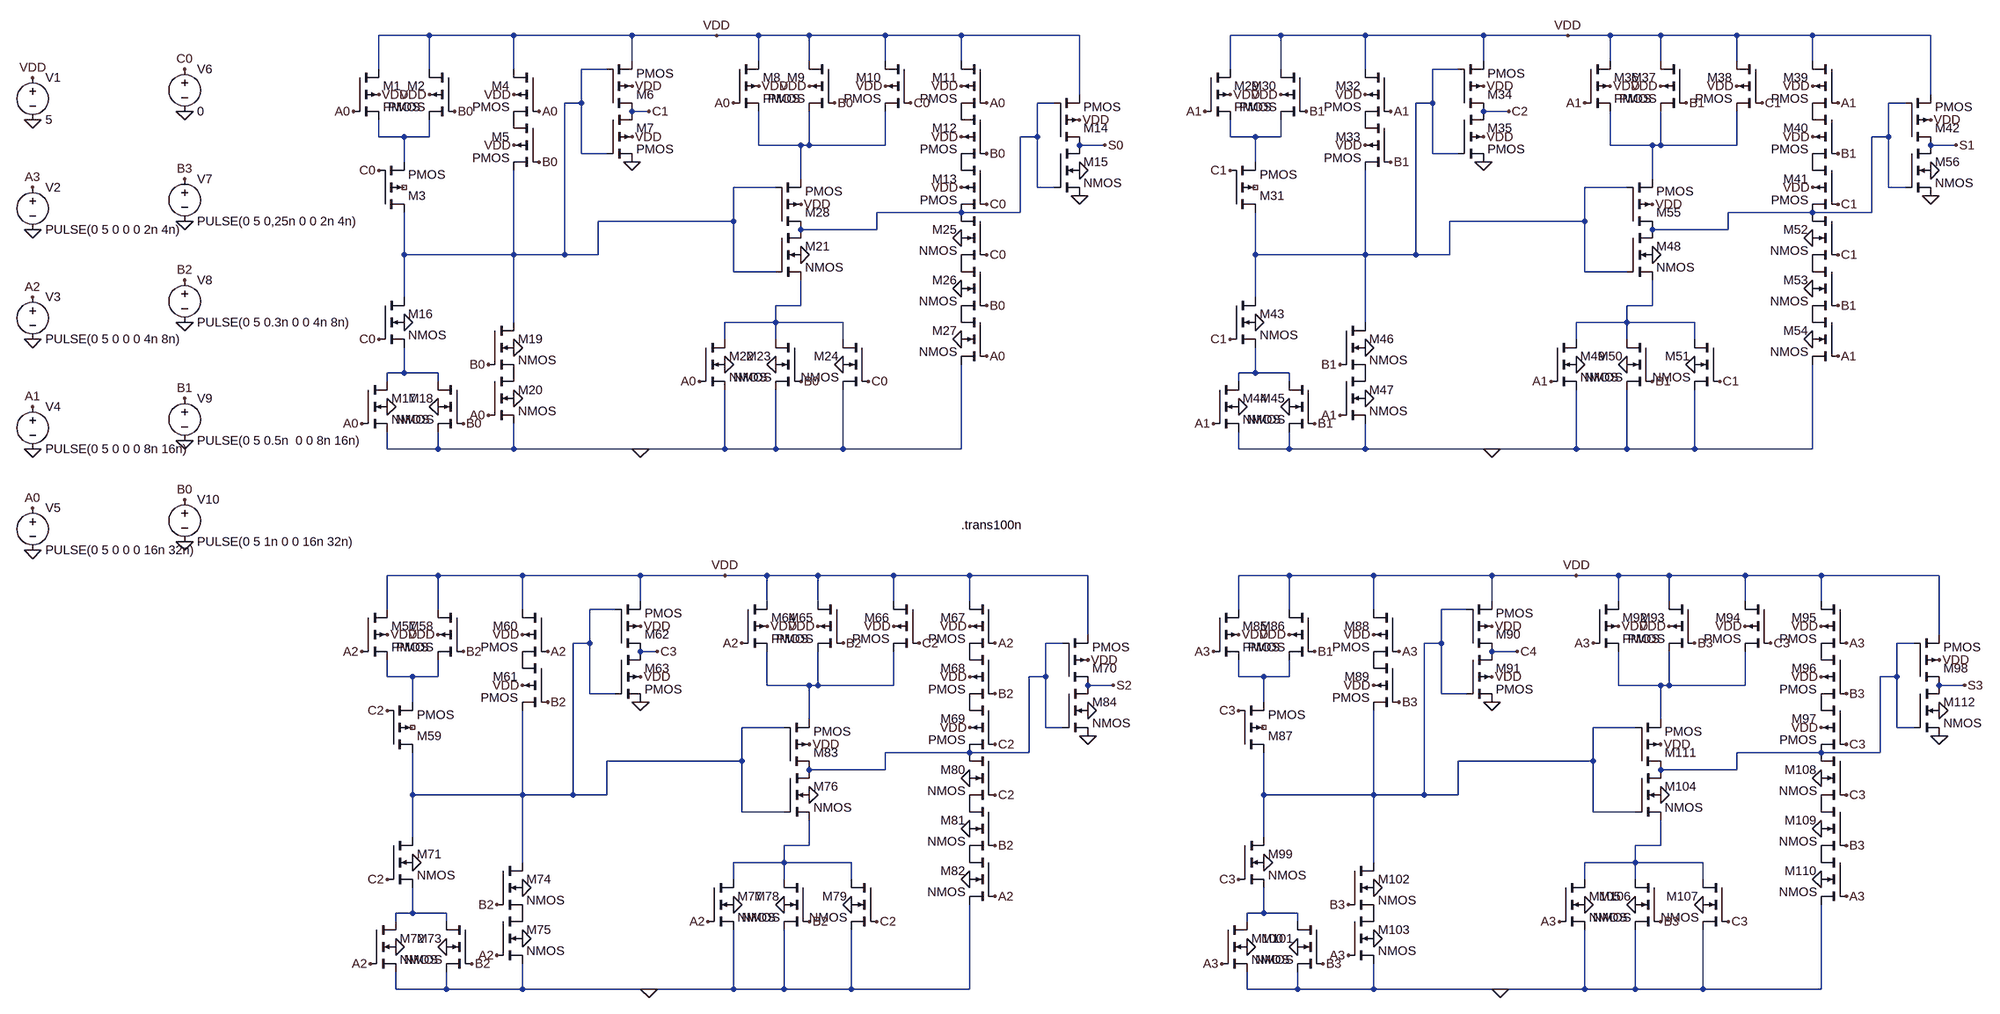
[diagram p0: schematic RIPPLE CARRY ADDER (1).asc]
RIPPLE CARRY ADDER (1).asc, the LTspice schematic file:
Version 4
SHEET 1 3168 1812
WIRE 160 -16 64 -16
WIRE 320 -16 160 -16
WIRE 544 -16 320 -16
WIRE 704 -16 544 -16
WIRE 784 -16 704 -16
WIRE 880 -16 784 -16
WIRE 1024 -16 880 -16
WIRE 1168 -16 1024 -16
WIRE 1392 -16 1168 -16
WIRE 1792 -16 1696 -16
WIRE 1952 -16 1792 -16
WIRE 2176 -16 1952 -16
WIRE 2336 -16 2176 -16
WIRE 2416 -16 2336 -16
WIRE 2512 -16 2416 -16
WIRE 2656 -16 2512 -16
WIRE 2800 -16 2656 -16
WIRE 3024 -16 2800 -16
WIRE 544 32 544 -16
WIRE 784 32 784 -16
WIRE 880 32 880 -16
WIRE 1024 32 1024 -16
WIRE 1168 32 1168 -16
WIRE 2176 32 2176 -16
WIRE 2416 32 2416 -16
WIRE 2512 32 2512 -16
WIRE 2656 32 2656 -16
WIRE 2800 32 2800 -16
WIRE 64 48 64 -16
WIRE 160 48 160 -16
WIRE 320 48 320 -16
WIRE 496 48 448 48
WIRE 1696 48 1696 -16
WIRE 1792 48 1792 -16
WIRE 1952 48 1952 -16
WIRE 2128 48 2080 48
WIRE 1392 96 1392 -16
WIRE 3024 96 3024 -16
WIRE 448 112 448 48
WIRE 448 112 416 112
WIRE 1344 112 1312 112
WIRE 2080 112 2080 48
WIRE 2080 112 2048 112
WIRE 2976 112 2944 112
WIRE 576 128 544 128
WIRE 2224 128 2176 128
WIRE 64 176 64 144
WIRE 112 176 64 176
WIRE 160 176 160 144
WIRE 160 176 112 176
WIRE 1312 176 1312 112
WIRE 1312 176 1280 176
WIRE 1696 176 1696 144
WIRE 1744 176 1696 176
WIRE 1792 176 1792 144
WIRE 1792 176 1744 176
WIRE 2944 176 2944 112
WIRE 2944 176 2912 176
WIRE 784 192 784 128
WIRE 864 192 784 192
WIRE 880 192 880 128
WIRE 880 192 864 192
WIRE 1024 192 1024 128
WIRE 1024 192 880 192
WIRE 1440 192 1392 192
WIRE 2416 192 2416 128
WIRE 2496 192 2416 192
WIRE 2512 192 2512 128
WIRE 2512 192 2496 192
WIRE 2656 192 2656 128
WIRE 2656 192 2512 192
WIRE 3072 192 3024 192
WIRE 448 208 448 112
WIRE 496 208 448 208
WIRE 2080 208 2080 112
WIRE 2128 208 2080 208
WIRE 112 224 112 176
WIRE 1744 224 1744 176
WIRE 864 256 864 192
WIRE 2496 256 2496 192
WIRE 816 272 736 272
WIRE 1312 272 1312 176
WIRE 1344 272 1312 272
WIRE 2448 272 2368 272
WIRE 2944 272 2944 176
WIRE 2976 272 2944 272
WIRE 1168 320 1008 320
WIRE 1280 320 1280 176
WIRE 1280 320 1168 320
WIRE 2800 320 2640 320
WIRE 2912 320 2912 176
WIRE 2912 320 2800 320
WIRE 736 336 736 272
WIRE 736 336 480 336
WIRE 2368 336 2368 272
WIRE 2368 336 2112 336
WIRE 1008 352 1008 320
WIRE 1008 352 864 352
WIRE 2640 352 2640 320
WIRE 2640 352 2496 352
WIRE 112 400 112 320
WIRE 320 400 320 240
WIRE 320 400 112 400
WIRE 416 400 416 112
WIRE 416 400 320 400
WIRE 480 400 480 336
WIRE 480 400 416 400
WIRE 1744 400 1744 320
WIRE 1952 400 1952 240
WIRE 1952 400 1744 400
WIRE 2048 400 2048 112
WIRE 2048 400 1952 400
WIRE 2112 400 2112 336
WIRE 2112 400 2048 400
WIRE 736 432 736 336
WIRE 816 432 736 432
WIRE 2368 432 2368 336
WIRE 2448 432 2368 432
WIRE 112 480 112 400
WIRE 1744 480 1744 400
WIRE 864 496 864 448
WIRE 864 496 816 496
WIRE 2496 496 2496 448
WIRE 2496 496 2448 496
WIRE 320 528 320 400
WIRE 816 528 816 496
WIRE 816 528 720 528
WIRE 944 528 816 528
WIRE 1952 528 1952 400
WIRE 2448 528 2448 496
WIRE 2448 528 2352 528
WIRE 2576 528 2448 528
WIRE 720 560 720 528
WIRE 816 560 816 528
WIRE 944 560 944 528
WIRE 2352 560 2352 528
WIRE 2448 560 2448 528
WIRE 2576 560 2576 528
WIRE 112 624 112 576
WIRE 112 624 80 624
WIRE 176 624 112 624
WIRE 1744 624 1744 576
WIRE 1744 624 1712 624
WIRE 1808 624 1744 624
WIRE 80 640 80 624
WIRE 176 640 176 624
WIRE 1712 640 1712 624
WIRE 1808 640 1808 624
WIRE 80 768 80 736
WIRE 176 768 176 736
WIRE 176 768 80 768
WIRE 320 768 320 720
WIRE 320 768 176 768
WIRE 560 768 320 768
WIRE 720 768 720 656
WIRE 720 768 560 768
WIRE 816 768 816 656
WIRE 816 768 720 768
WIRE 944 768 944 656
WIRE 944 768 816 768
WIRE 1168 768 1168 608
WIRE 1168 768 944 768
WIRE 1712 768 1712 736
WIRE 1808 768 1808 736
WIRE 1808 768 1712 768
WIRE 1952 768 1952 720
WIRE 1952 768 1808 768
WIRE 2192 768 1952 768
WIRE 2352 768 2352 656
WIRE 2352 768 2192 768
WIRE 2448 768 2448 656
WIRE 2448 768 2352 768
WIRE 2576 768 2576 656
WIRE 2576 768 2448 768
WIRE 2800 768 2800 608
WIRE 2800 768 2576 768
WIRE 176 1008 80 1008
WIRE 336 1008 176 1008
WIRE 560 1008 336 1008
WIRE 720 1008 560 1008
WIRE 800 1008 720 1008
WIRE 896 1008 800 1008
WIRE 1040 1008 896 1008
WIRE 1184 1008 1040 1008
WIRE 1408 1008 1184 1008
WIRE 1808 1008 1712 1008
WIRE 1968 1008 1808 1008
WIRE 2192 1008 1968 1008
WIRE 2352 1008 2192 1008
WIRE 2432 1008 2352 1008
WIRE 2528 1008 2432 1008
WIRE 2672 1008 2528 1008
WIRE 2816 1008 2672 1008
WIRE 3040 1008 2816 1008
WIRE 560 1056 560 1008
WIRE 800 1056 800 1008
WIRE 896 1056 896 1008
WIRE 1040 1056 1040 1008
WIRE 1184 1056 1184 1008
WIRE 2192 1056 2192 1008
WIRE 2432 1056 2432 1008
WIRE 2528 1056 2528 1008
WIRE 2672 1056 2672 1008
WIRE 2816 1056 2816 1008
WIRE 80 1072 80 1008
WIRE 176 1072 176 1008
WIRE 336 1072 336 1008
WIRE 512 1072 464 1072
WIRE 1712 1072 1712 1008
WIRE 1808 1072 1808 1008
WIRE 1968 1072 1968 1008
WIRE 2144 1072 2096 1072
WIRE 1408 1120 1408 1008
WIRE 3040 1120 3040 1008
WIRE 464 1136 464 1072
WIRE 464 1136 432 1136
WIRE 1360 1136 1328 1136
WIRE 2096 1136 2096 1072
WIRE 2096 1136 2064 1136
WIRE 2992 1136 2960 1136
WIRE 592 1152 560 1152
WIRE 2240 1152 2192 1152
WIRE 80 1200 80 1168
WIRE 128 1200 80 1200
WIRE 176 1200 176 1168
WIRE 176 1200 128 1200
WIRE 1328 1200 1328 1136
WIRE 1328 1200 1296 1200
WIRE 1712 1200 1712 1168
WIRE 1760 1200 1712 1200
WIRE 1808 1200 1808 1168
WIRE 1808 1200 1760 1200
WIRE 2960 1200 2960 1136
WIRE 2960 1200 2928 1200
WIRE 800 1216 800 1152
WIRE 880 1216 800 1216
WIRE 896 1216 896 1152
WIRE 896 1216 880 1216
WIRE 1040 1216 1040 1152
WIRE 1040 1216 896 1216
WIRE 1456 1216 1408 1216
WIRE 2432 1216 2432 1152
WIRE 2512 1216 2432 1216
WIRE 2528 1216 2528 1152
WIRE 2528 1216 2512 1216
WIRE 2672 1216 2672 1152
WIRE 2672 1216 2528 1216
WIRE 3088 1216 3040 1216
WIRE 464 1232 464 1136
WIRE 512 1232 464 1232
WIRE 2096 1232 2096 1136
WIRE 2144 1232 2096 1232
WIRE 128 1248 128 1200
WIRE 1760 1248 1760 1200
WIRE 880 1280 880 1216
WIRE 2512 1280 2512 1216
WIRE 832 1296 752 1296
WIRE 1328 1296 1328 1200
WIRE 1360 1296 1328 1296
WIRE 2464 1296 2384 1296
WIRE 2960 1296 2960 1200
WIRE 2992 1296 2960 1296
WIRE 1184 1344 1024 1344
WIRE 1296 1344 1296 1200
WIRE 1296 1344 1184 1344
WIRE 2816 1344 2656 1344
WIRE 2928 1344 2928 1200
WIRE 2928 1344 2816 1344
WIRE 752 1360 752 1296
WIRE 752 1360 496 1360
WIRE 2384 1360 2384 1296
WIRE 2384 1360 2128 1360
WIRE 1024 1376 1024 1344
WIRE 1024 1376 880 1376
WIRE 2656 1376 2656 1344
WIRE 2656 1376 2512 1376
WIRE 128 1424 128 1344
WIRE 336 1424 336 1264
WIRE 336 1424 128 1424
WIRE 432 1424 432 1136
WIRE 432 1424 336 1424
WIRE 496 1424 496 1360
WIRE 496 1424 432 1424
WIRE 1760 1424 1760 1344
WIRE 1968 1424 1968 1264
WIRE 1968 1424 1760 1424
WIRE 2064 1424 2064 1136
WIRE 2064 1424 1968 1424
WIRE 2128 1424 2128 1360
WIRE 2128 1424 2064 1424
WIRE 752 1456 752 1360
WIRE 832 1456 752 1456
WIRE 2384 1456 2384 1360
WIRE 2464 1456 2384 1456
WIRE 128 1504 128 1424
WIRE 1760 1504 1760 1424
WIRE 880 1520 880 1472
WIRE 880 1520 832 1520
WIRE 2512 1520 2512 1472
WIRE 2512 1520 2464 1520
WIRE 336 1552 336 1424
WIRE 832 1552 832 1520
WIRE 832 1552 736 1552
WIRE 960 1552 832 1552
WIRE 1968 1552 1968 1424
WIRE 2464 1552 2464 1520
WIRE 2464 1552 2368 1552
WIRE 2592 1552 2464 1552
WIRE 736 1584 736 1552
WIRE 832 1584 832 1552
WIRE 960 1584 960 1552
WIRE 2368 1584 2368 1552
WIRE 2464 1584 2464 1552
WIRE 2592 1584 2592 1552
WIRE 128 1648 128 1600
WIRE 128 1648 96 1648
WIRE 192 1648 128 1648
WIRE 1760 1648 1760 1600
WIRE 1760 1648 1728 1648
WIRE 1824 1648 1760 1648
WIRE 96 1664 96 1648
WIRE 192 1664 192 1648
WIRE 1728 1664 1728 1648
WIRE 1824 1664 1824 1648
WIRE 96 1792 96 1760
WIRE 192 1792 192 1760
WIRE 192 1792 96 1792
WIRE 336 1792 336 1744
WIRE 336 1792 192 1792
WIRE 576 1792 336 1792
WIRE 736 1792 736 1680
WIRE 736 1792 576 1792
WIRE 832 1792 832 1680
WIRE 832 1792 736 1792
WIRE 960 1792 960 1680
WIRE 960 1792 832 1792
WIRE 1184 1792 1184 1632
WIRE 1184 1792 960 1792
WIRE 1728 1792 1728 1760
WIRE 1824 1792 1824 1760
WIRE 1824 1792 1728 1792
WIRE 1968 1792 1968 1744
WIRE 1968 1792 1824 1792
WIRE 2208 1792 1968 1792
WIRE 2368 1792 2368 1680
WIRE 2368 1792 2208 1792
WIRE 2464 1792 2464 1680
WIRE 2464 1792 2368 1792
WIRE 2592 1792 2592 1680
WIRE 2592 1792 2464 1792
WIRE 2816 1792 2816 1632
WIRE 2816 1792 2592 1792
FLAG 560 768 0
FLAG 320 576 0
FLAG 320 672 0
FLAG 80 688 0
FLAG 176 688 0
FLAG 112 528 0
FLAG 720 608 0
FLAG 816 608 0
FLAG 944 608 0
FLAG 864 400 0
FLAG 1168 368 0
FLAG 1168 464 0
FLAG 1168 560 0
FLAG 64 96 VDD
FLAG 160 96 VDD
FLAG 704 -16 VDD
FLAG 544 80 VDD
FLAG 544 176 VDD
FLAG 320 96 VDD
FLAG 320 192 VDD
FLAG 784 80 VDD
FLAG 880 80 VDD
FLAG 864 304 VDD
FLAG 1024 80 VDD
FLAG 1168 80 VDD
FLAG 1168 176 VDD
FLAG 1168 272 VDD
FLAG 1392 144 VDD
FLAG 1392 288 0
FLAG 1392 240 0
FLAG -592 64 VDD
FLAG -592 272 A3
FLAG -592 480 A2
FLAG -592 688 A1
FLAG -592 880 A0
FLAG -304 48 C0
FLAG -304 864 B0
FLAG -304 672 B1
FLAG -304 448 B2
FLAG -304 256 B3
FLAG -592 352 0
FLAG -592 560 0
FLAG -592 768 0
FLAG -592 960 0
FLAG -304 944 0
FLAG -304 752 0
FLAG -304 528 0
FLAG -304 336 0
FLAG -304 128 0
FLAG -592 144 0
FLAG 32 720 A0
FLAG 272 704 A0
FLAG 368 128 A0
FLAG 16 128 A0
FLAG 736 112 A0
FLAG 1216 112 A0
FLAG 1216 592 A0
FLAG 672 640 A0
FLAG 208 128 B0
FLAG 368 224 B0
FLAG 272 608 B0
FLAG 224 720 B0
FLAG 928 112 B0
FLAG 864 640 B0
FLAG 1216 208 B0
FLAG 1216 496 B0
FLAG 64 240 C0
FLAG 64 560 C0
FLAG 1072 112 C0
FLAG 992 640 C0
FLAG 1216 400 C0
FLAG 1216 304 C0
FLAG 544 224 0
FLAG 1440 192 S0
FLAG 2192 768 0
FLAG 1952 576 0
FLAG 1952 672 0
FLAG 1712 688 0
FLAG 1808 688 0
FLAG 1744 528 0
FLAG 2352 608 0
FLAG 2448 608 0
FLAG 2576 608 0
FLAG 2496 400 0
FLAG 2800 368 0
FLAG 2800 464 0
FLAG 2800 560 0
FLAG 1696 96 VDD
FLAG 1792 96 VDD
FLAG 2336 -16 VDD
FLAG 2176 80 VDD
FLAG 2176 176 VDD
FLAG 1952 96 VDD
FLAG 1952 192 VDD
FLAG 2416 80 VDD
FLAG 2512 80 VDD
FLAG 2496 304 VDD
FLAG 2656 80 VDD
FLAG 2800 80 VDD
FLAG 2800 176 VDD
FLAG 2800 272 VDD
FLAG 3024 144 VDD
FLAG 3024 288 0
FLAG 3024 240 0
FLAG 2176 224 0
FLAG 1648 128 A1
FLAG 2000 128 A1
FLAG 2368 112 A1
FLAG 2848 112 A1
FLAG 2304 640 A1
FLAG 1904 704 A1
FLAG 1664 720 A1
FLAG 1840 128 B1
FLAG 2000 224 B1
FLAG 2560 112 B1
FLAG 2848 208 B1
FLAG 2848 496 B1
FLAG 2496 640 B1
FLAG 1904 608 B1
FLAG 1856 720 B1
FLAG 2848 592 A1
FLAG 1696 240 C1
FLAG 2704 112 C1
FLAG 2848 304 C1
FLAG 2848 400 C1
FLAG 2624 640 C1
FLAG 1696 560 C1
FLAG 3072 192 S1
FLAG 576 128 C1
FLAG 2224 128 C2
FLAG 576 1792 0
FLAG 336 1600 0
FLAG 336 1696 0
FLAG 96 1712 0
FLAG 192 1712 0
FLAG 128 1552 0
FLAG 736 1632 0
FLAG 832 1632 0
FLAG 960 1632 0
FLAG 880 1424 0
FLAG 1184 1392 0
FLAG 1184 1488 0
FLAG 1184 1584 0
FLAG 80 1120 VDD
FLAG 176 1120 VDD
FLAG 720 1008 VDD
FLAG 560 1104 VDD
FLAG 560 1200 VDD
FLAG 336 1120 VDD
FLAG 336 1216 VDD
FLAG 800 1104 VDD
FLAG 896 1104 VDD
FLAG 880 1328 VDD
FLAG 1040 1104 VDD
FLAG 1184 1104 VDD
FLAG 1184 1200 VDD
FLAG 1184 1296 VDD
FLAG 1408 1168 VDD
FLAG 1408 1312 0
FLAG 1408 1264 0
FLAG 560 1248 0
FLAG 2208 1792 0
FLAG 1968 1600 0
FLAG 1968 1696 0
FLAG 1728 1712 0
FLAG 1824 1712 0
FLAG 1760 1552 0
FLAG 2368 1632 0
FLAG 2464 1632 0
FLAG 2592 1632 0
FLAG 2512 1424 0
FLAG 2816 1392 0
FLAG 2816 1488 0
FLAG 2816 1584 0
FLAG 1712 1120 VDD
FLAG 1808 1120 VDD
FLAG 2352 1008 VDD
FLAG 2192 1104 VDD
FLAG 2192 1200 VDD
FLAG 1968 1120 VDD
FLAG 1968 1216 VDD
FLAG 2432 1104 VDD
FLAG 2528 1104 VDD
FLAG 2512 1328 VDD
FLAG 2672 1104 VDD
FLAG 2816 1104 VDD
FLAG 2816 1200 VDD
FLAG 2816 1296 VDD
FLAG 3040 1168 VDD
FLAG 3040 1312 0
FLAG 3040 1264 0
FLAG 2192 1248 0
FLAG 1856 1152 B1
FLAG 32 1152 A2
FLAG 384 1152 A2
FLAG 752 1136 A2
FLAG 1232 1136 A2
FLAG 48 1744 A2
FLAG 288 1728 A2
FLAG 1232 1616 A2
FLAG 688 1664 A2
FLAG 224 1152 B2
FLAG 384 1248 B2
FLAG 944 1136 B2
FLAG 1232 1232 B2
FLAG 1232 1520 B2
FLAG 880 1664 B2
FLAG 240 1744 B2
FLAG 80 1264 C2
FLAG 80 1584 C2
FLAG 1008 1664 C2
FLAG 1232 1424 C2
FLAG 1232 1328 C2
FLAG 1088 1136 C2
FLAG 288 1632 B2
FLAG 1664 1152 A3
FLAG 1680 1744 A3
FLAG 1920 1728 A3
FLAG 2320 1664 A3
FLAG 2384 1136 A3
FLAG 2864 1136 A3
FLAG 2864 1616 A3
FLAG 2016 1152 A3
FLAG 2016 1248 B3
FLAG 2576 1136 B3
FLAG 2864 1232 B3
FLAG 2864 1520 B3
FLAG 2512 1664 B3
FLAG 1920 1632 B3
FLAG 1872 1744 B3
FLAG 1712 1264 C3
FLAG 1712 1584 C3
FLAG 2720 1136 C3
FLAG 2864 1328 C3
FLAG 2864 1424 C3
FLAG 2640 1664 C3
FLAG 1456 1216 S2
FLAG 3088 1216 S3
FLAG 592 1152 C3
FLAG 2240 1152 C4
SYMBOL pmos4 16 48 R0
SYMATTR InstName M1
SYMBOL pmos4 208 48 M0
SYMATTR InstName M2
SYMBOL pmos4 64 320 M180
SYMATTR InstName M3
SYMBOL pmos4 368 48 M0
SYMATTR InstName M4
SYMBOL pmos4 368 144 M0
SYMATTR InstName M5
SYMBOL pmos4 496 128 M180
SYMATTR InstName M6
SYMBOL pmos4 496 128 R0
SYMATTR InstName M7
SYMBOL pmos4 736 32 R0
SYMATTR InstName M8
SYMBOL pmos4 928 32 M0
SYMATTR InstName M9
SYMBOL pmos4 1072 32 M0
SYMATTR InstName M10
SYMBOL pmos4 1216 32 M0
SYMATTR InstName M11
SYMBOL pmos4 1216 128 M0
SYMATTR InstName M12
SYMBOL pmos4 1216 224 M0
SYMATTR InstName M13
SYMBOL pmos4 1344 192 M180
SYMATTR InstName M14
SYMBOL nmos4 64 480 R0
SYMATTR InstName M16
SYMBOL nmos4 32 640 R0
SYMATTR InstName M17
SYMBOL nmos4 224 640 M0
SYMATTR InstName M18
SYMBOL nmos4 272 528 R0
SYMATTR InstName M19
SYMBOL nmos4 272 624 R0
SYMATTR InstName M20
SYMBOL nmos4 816 352 R0
SYMATTR InstName M21
SYMBOL nmos4 672 560 R0
SYMATTR InstName M22
SYMBOL nmos4 864 560 M0
SYMATTR InstName M23
SYMBOL nmos4 992 560 M0
SYMATTR InstName M24
SYMBOL nmos4 1216 320 M0
SYMATTR InstName M25
SYMBOL nmos4 1216 416 M0
SYMATTR InstName M26
SYMBOL nmos4 1216 512 M0
SYMATTR InstName M27
SYMBOL pmos4 816 352 M180
SYMATTR InstName M28
SYMBOL nmos4 1344 192 R0
SYMATTR InstName M15
SYMBOL voltage -592 48 R0
SYMATTR InstName V1
SYMATTR Value 5
SYMBOL voltage -592 256 R0
WINDOW 123 0 0 Left 0
WINDOW 39 0 0 Left 0
SYMATTR InstName V2
SYMATTR Value PULSE(0 5 0 0 0 2n 4n)
SYMBOL voltage -592 464 R0
SYMATTR InstName V3
SYMATTR Value PULSE(0 5 0 0 0 4n 8n)
SYMBOL voltage -592 672 R0
SYMATTR InstName V4
SYMATTR Value PULSE(0 5 0 0 0 8n 16n)
SYMBOL voltage -592 864 R0
SYMATTR InstName V5
SYMATTR Value PULSE(0 5 0 0 0 16n 32n)
SYMBOL voltage -304 32 R0
SYMATTR InstName V6
SYMATTR Value 0
SYMBOL voltage -304 240 R0
SYMATTR InstName V7
SYMATTR Value PULSE(0 5 0,25n 0 0 2n 4n)
SYMBOL voltage -304 432 R0
SYMATTR InstName V8
SYMATTR Value PULSE(0 5 0.3n 0 0 4n 8n)
SYMBOL voltage -304 656 R0
SYMATTR InstName V9
SYMATTR Value PULSE(0 5 0.5n  0 0 8n 16n)
SYMBOL voltage -304 848 R0
SYMATTR InstName V10
SYMATTR Value PULSE(0 5 1n 0 0 16n 32n)
SYMBOL pmos4 1648 48 R0
SYMATTR InstName M29
SYMBOL pmos4 1840 48 M0
SYMATTR InstName M30
SYMBOL pmos4 1696 320 M180
SYMATTR InstName M31
SYMBOL pmos4 2000 48 M0
SYMATTR InstName M32
SYMBOL pmos4 2000 144 M0
SYMATTR InstName M33
SYMBOL pmos4 2128 128 M180
SYMATTR InstName M34
SYMBOL pmos4 2128 128 R0
SYMATTR InstName M35
SYMBOL pmos4 2368 32 R0
SYMATTR InstName M36
SYMBOL pmos4 2560 32 M0
SYMATTR InstName M37
SYMBOL pmos4 2704 32 M0
SYMATTR InstName M38
SYMBOL pmos4 2848 32 M0
SYMATTR InstName M39
SYMBOL pmos4 2848 128 M0
SYMATTR InstName M40
SYMBOL pmos4 2848 224 M0
SYMATTR InstName M41
SYMBOL pmos4 2976 192 M180
SYMATTR InstName M42
SYMBOL nmos4 1696 480 R0
SYMATTR InstName M43
SYMBOL nmos4 1664 640 R0
SYMATTR InstName M44
SYMBOL nmos4 1856 640 M0
SYMATTR InstName M45
SYMBOL nmos4 1904 528 R0
SYMATTR InstName M46
SYMBOL nmos4 1904 624 R0
SYMATTR InstName M47
SYMBOL nmos4 2448 352 R0
SYMATTR InstName M48
SYMBOL nmos4 2304 560 R0
SYMATTR InstName M49
SYMBOL nmos4 2496 560 M0
SYMATTR InstName M50
SYMBOL nmos4 2624 560 M0
SYMATTR InstName M51
SYMBOL nmos4 2848 320 M0
SYMATTR InstName M52
SYMBOL nmos4 2848 416 M0
SYMATTR InstName M53
SYMBOL nmos4 2848 512 M0
SYMATTR InstName M54
SYMBOL pmos4 2448 352 M180
SYMATTR InstName M55
SYMBOL nmos4 2976 192 R0
SYMATTR InstName M56
SYMBOL pmos4 32 1072 R0
SYMATTR InstName M57
SYMBOL pmos4 224 1072 M0
SYMATTR InstName M58
SYMBOL pmos4 80 1344 M180
SYMATTR InstName M59
SYMBOL pmos4 384 1072 M0
SYMATTR InstName M60
SYMBOL pmos4 384 1168 M0
SYMATTR InstName M61
SYMBOL pmos4 512 1152 M180
SYMATTR InstName M62
SYMBOL pmos4 512 1152 R0
SYMATTR InstName M63
SYMBOL pmos4 752 1056 R0
SYMATTR InstName M64
SYMBOL pmos4 944 1056 M0
SYMATTR InstName M65
SYMBOL pmos4 1088 1056 M0
SYMATTR InstName M66
SYMBOL pmos4 1232 1056 M0
SYMATTR InstName M67
SYMBOL pmos4 1232 1152 M0
SYMATTR InstName M68
SYMBOL pmos4 1232 1248 M0
SYMATTR InstName M69
SYMBOL pmos4 1360 1216 M180
SYMATTR InstName M70
SYMBOL nmos4 80 1504 R0
SYMATTR InstName M71
SYMBOL nmos4 48 1664 R0
SYMATTR InstName M72
SYMBOL nmos4 240 1664 M0
SYMATTR InstName M73
SYMBOL nmos4 288 1552 R0
SYMATTR InstName M74
SYMBOL nmos4 288 1648 R0
SYMATTR InstName M75
SYMBOL nmos4 832 1376 R0
SYMATTR InstName M76
SYMBOL nmos4 688 1584 R0
SYMATTR InstName M77
SYMBOL nmos4 880 1584 M0
SYMATTR InstName M78
SYMBOL nmos4 1008 1584 M0
SYMATTR InstName M79
SYMBOL nmos4 1232 1344 M0
SYMATTR InstName M80
SYMBOL nmos4 1232 1440 M0
SYMATTR InstName M81
SYMBOL nmos4 1232 1536 M0
SYMATTR InstName M82
SYMBOL pmos4 832 1376 M180
SYMATTR InstName M83
SYMBOL nmos4 1360 1216 R0
SYMATTR InstName M84
SYMBOL pmos4 1664 1072 R0
SYMATTR InstName M85
SYMBOL pmos4 1856 1072 M0
SYMATTR InstName M86
SYMBOL pmos4 1712 1344 M180
SYMATTR InstName M87
SYMBOL pmos4 2016 1072 M0
SYMATTR InstName M88
SYMBOL pmos4 2016 1168 M0
SYMATTR InstName M89
SYMBOL pmos4 2144 1152 M180
SYMATTR InstName M90
SYMBOL pmos4 2144 1152 R0
SYMATTR InstName M91
SYMBOL pmos4 2384 1056 R0
SYMATTR InstName M92
SYMBOL pmos4 2576 1056 M0
SYMATTR InstName M93
SYMBOL pmos4 2720 1056 M0
SYMATTR InstName M94
SYMBOL pmos4 2864 1056 M0
SYMATTR InstName M95
SYMBOL pmos4 2864 1152 M0
SYMATTR InstName M96
SYMBOL pmos4 2864 1248 M0
SYMATTR InstName M97
SYMBOL pmos4 2992 1216 M180
SYMATTR InstName M98
SYMBOL nmos4 1712 1504 R0
SYMATTR InstName M99
SYMBOL nmos4 1680 1664 R0
SYMATTR InstName M100
SYMBOL nmos4 1872 1664 M0
SYMATTR InstName M101
SYMBOL nmos4 1920 1552 R0
SYMATTR InstName M102
SYMBOL nmos4 1920 1648 R0
SYMATTR InstName M103
SYMBOL nmos4 2464 1376 R0
SYMATTR InstName M104
SYMBOL nmos4 2320 1584 R0
SYMATTR InstName M105
SYMBOL nmos4 2512 1584 M0
SYMATTR InstName M106
SYMBOL nmos4 2640 1584 M0
SYMATTR InstName M107
SYMBOL nmos4 2864 1344 M0
SYMATTR InstName M108
SYMBOL nmos4 2864 1440 M0
SYMATTR InstName M109
SYMBOL nmos4 2864 1536 M0
SYMATTR InstName M110
SYMBOL pmos4 2464 1376 M180
SYMATTR InstName M111
SYMBOL nmos4 2992 1216 R0
SYMATTR InstName M112
TEXT 1168 912 Left 2 !.trans100n

The netlist it stands for:
* RIPPLE CARRY ADDER (1).asc
M1 VDD A0 N005 VDD PMOS
M2 VDD B0 N005 VDD PMOS
M3 N001 C0 N005 NC_01 PMOS
M4 VDD A0 P001 VDD PMOS
M5 P001 B0 N001 VDD PMOS
M6 C1 N001 VDD VDD PMOS
M7 C1 N001 0 VDD PMOS
M8 VDD A0 N007 VDD PMOS
M9 VDD B0 N007 VDD PMOS
M10 VDD C0 N007 VDD PMOS
M11 VDD A0 P002 VDD PMOS
M12 P002 B0 P003 VDD PMOS
M13 P003 C0 N003 VDD PMOS
M14 S0 N003 VDD VDD PMOS
M16 N001 C0 N011 0 NMOS
M17 N011 A0 0 0 NMOS
M18 N011 B0 0 0 NMOS
M19 N001 B0 P004 0 NMOS
M20 P004 A0 0 0 NMOS
M21 N003 N001 N009 0 NMOS
M22 N009 A0 0 0 NMOS
M23 N009 B0 0 0 NMOS
M24 N009 C0 0 0 NMOS
M25 N003 C0 P005 0 NMOS
M26 P005 B0 P006 0 NMOS
M27 P006 A0 0 0 NMOS
M28 N003 N001 N007 VDD PMOS
M15 S0 N003 0 0 NMOS
V1 VDD 0 5
V2 A3 0 PULSE(0 5 0 0 0 2n 4n)
V3 A2 0 PULSE(0 5 0 0 0 4n 8n)
V4 A1 0 PULSE(0 5 0 0 0 8n 16n)
V5 A0 0 PULSE(0 5 0 0 0 16n 32n)
V6 C0 0 0
V7 B3 0 PULSE(0 5 0,25n 0 0 2n 4n)
V8 B2 0 PULSE(0 5 0.3n 0 0 4n 8n)
V9 B1 0 PULSE(0 5 0.5n  0 0 8n 16n)
V10 B0 0 PULSE(0 5 1n 0 0 16n 32n)
M29 VDD A1 N006 VDD PMOS
M30 VDD B1 N006 VDD PMOS
M31 N002 C1 N006 NC_02 PMOS
M32 VDD A1 P007 VDD PMOS
M33 P007 B1 N002 VDD PMOS
M34 C2 N002 VDD VDD PMOS
M35 C2 N002 0 VDD PMOS
M36 VDD A1 N008 VDD PMOS
M37 VDD B1 N008 VDD PMOS
M38 VDD C1 N008 VDD PMOS
M39 VDD A1 P008 VDD PMOS
M40 P008 B1 P009 VDD PMOS
M41 P009 C1 N004 VDD PMOS
M42 S1 N004 VDD VDD PMOS
M43 N002 C1 N012 0 NMOS
M44 N012 A1 0 0 NMOS
M45 N012 B1 0 0 NMOS
M46 N002 B1 P010 0 NMOS
M47 P010 A1 0 0 NMOS
M48 N004 N002 N010 0 NMOS
M49 N010 A1 0 0 NMOS
M50 N010 B1 0 0 NMOS
M51 N010 C1 0 0 NMOS
M52 N004 C1 P011 0 NMOS
M53 P011 B1 P012 0 NMOS
M54 P012 A1 0 0 NMOS
M55 N004 N002 N008 VDD PMOS
M56 S1 N004 0 0 NMOS
M57 VDD A2 N017 VDD PMOS
M58 VDD B2 N017 VDD PMOS
M59 N013 C2 N017 NC_03 PMOS
M60 VDD A2 P013 VDD PMOS
M61 P013 B2 N013 VDD PMOS
M62 C3 N013 VDD VDD PMOS
M63 C3 N013 0 VDD PMOS
M64 VDD A2 N019 VDD PMOS
M65 VDD B2 N019 VDD PMOS
M66 VDD C2 N019 VDD PMOS
M67 VDD A2 P014 VDD PMOS
M68 P014 B2 P015 VDD PMOS
M69 P015 C2 N015 VDD PMOS
M70 S2 N015 VDD VDD PMOS
M71 N013 C2 N023 0 NMOS
M72 N023 A2 0 0 NMOS
M73 N023 B2 0 0 NMOS
M74 N013 B2 P016 0 NMOS
M75 P016 A2 0 0 NMOS
M76 N015 N013 N021 0 NMOS
M77 N021 A2 0 0 NMOS
M78 N021 B2 0 0 NMOS
M79 N021 C2 0 0 NMOS
M80 N015 C2 P017 0 NMOS
M81 P017 B2 P018 0 NMOS
M82 P018 A2 0 0 NMOS
M83 N015 N013 N019 VDD PMOS
M84 S2 N015 0 0 NMOS
M85 VDD A3 N018 VDD PMOS
M86 VDD B1 N018 VDD PMOS
M87 N014 C3 N018 NC_04 PMOS
M88 VDD A3 P019 VDD PMOS
M89 P019 B3 N014 VDD PMOS
M90 C4 N014 VDD VDD PMOS
M91 C4 N014 0 VDD PMOS
M92 VDD A3 N020 VDD PMOS
M93 VDD B3 N020 VDD PMOS
M94 VDD C3 N020 VDD PMOS
M95 VDD A3 P020 VDD PMOS
M96 P020 B3 P021 VDD PMOS
M97 P021 C3 N016 VDD PMOS
M98 S3 N016 VDD VDD PMOS
M99 N014 C3 N024 0 NMOS
M100 N024 A3 0 0 NMOS
M101 N024 B3 0 0 NMOS
M102 N014 B3 P022 0 NMOS
M103 P022 A3 0 0 NMOS
M104 N016 N014 N022 0 NMOS
M105 N022 A3 0 0 NMOS
M106 N022 B3 0 0 NMOS
M107 N022 C3 0 0 NMOS
M108 N016 C3 P023 0 NMOS
M109 P023 B3 P024 0 NMOS
M110 P024 A3 0 0 NMOS
M111 N016 N014 N020 VDD PMOS
M112 S3 N016 0 0 NMOS
.model NMOS NMOS
.model PMOS PMOS
.lib standard.mos
.trans100n
.backanno
.end